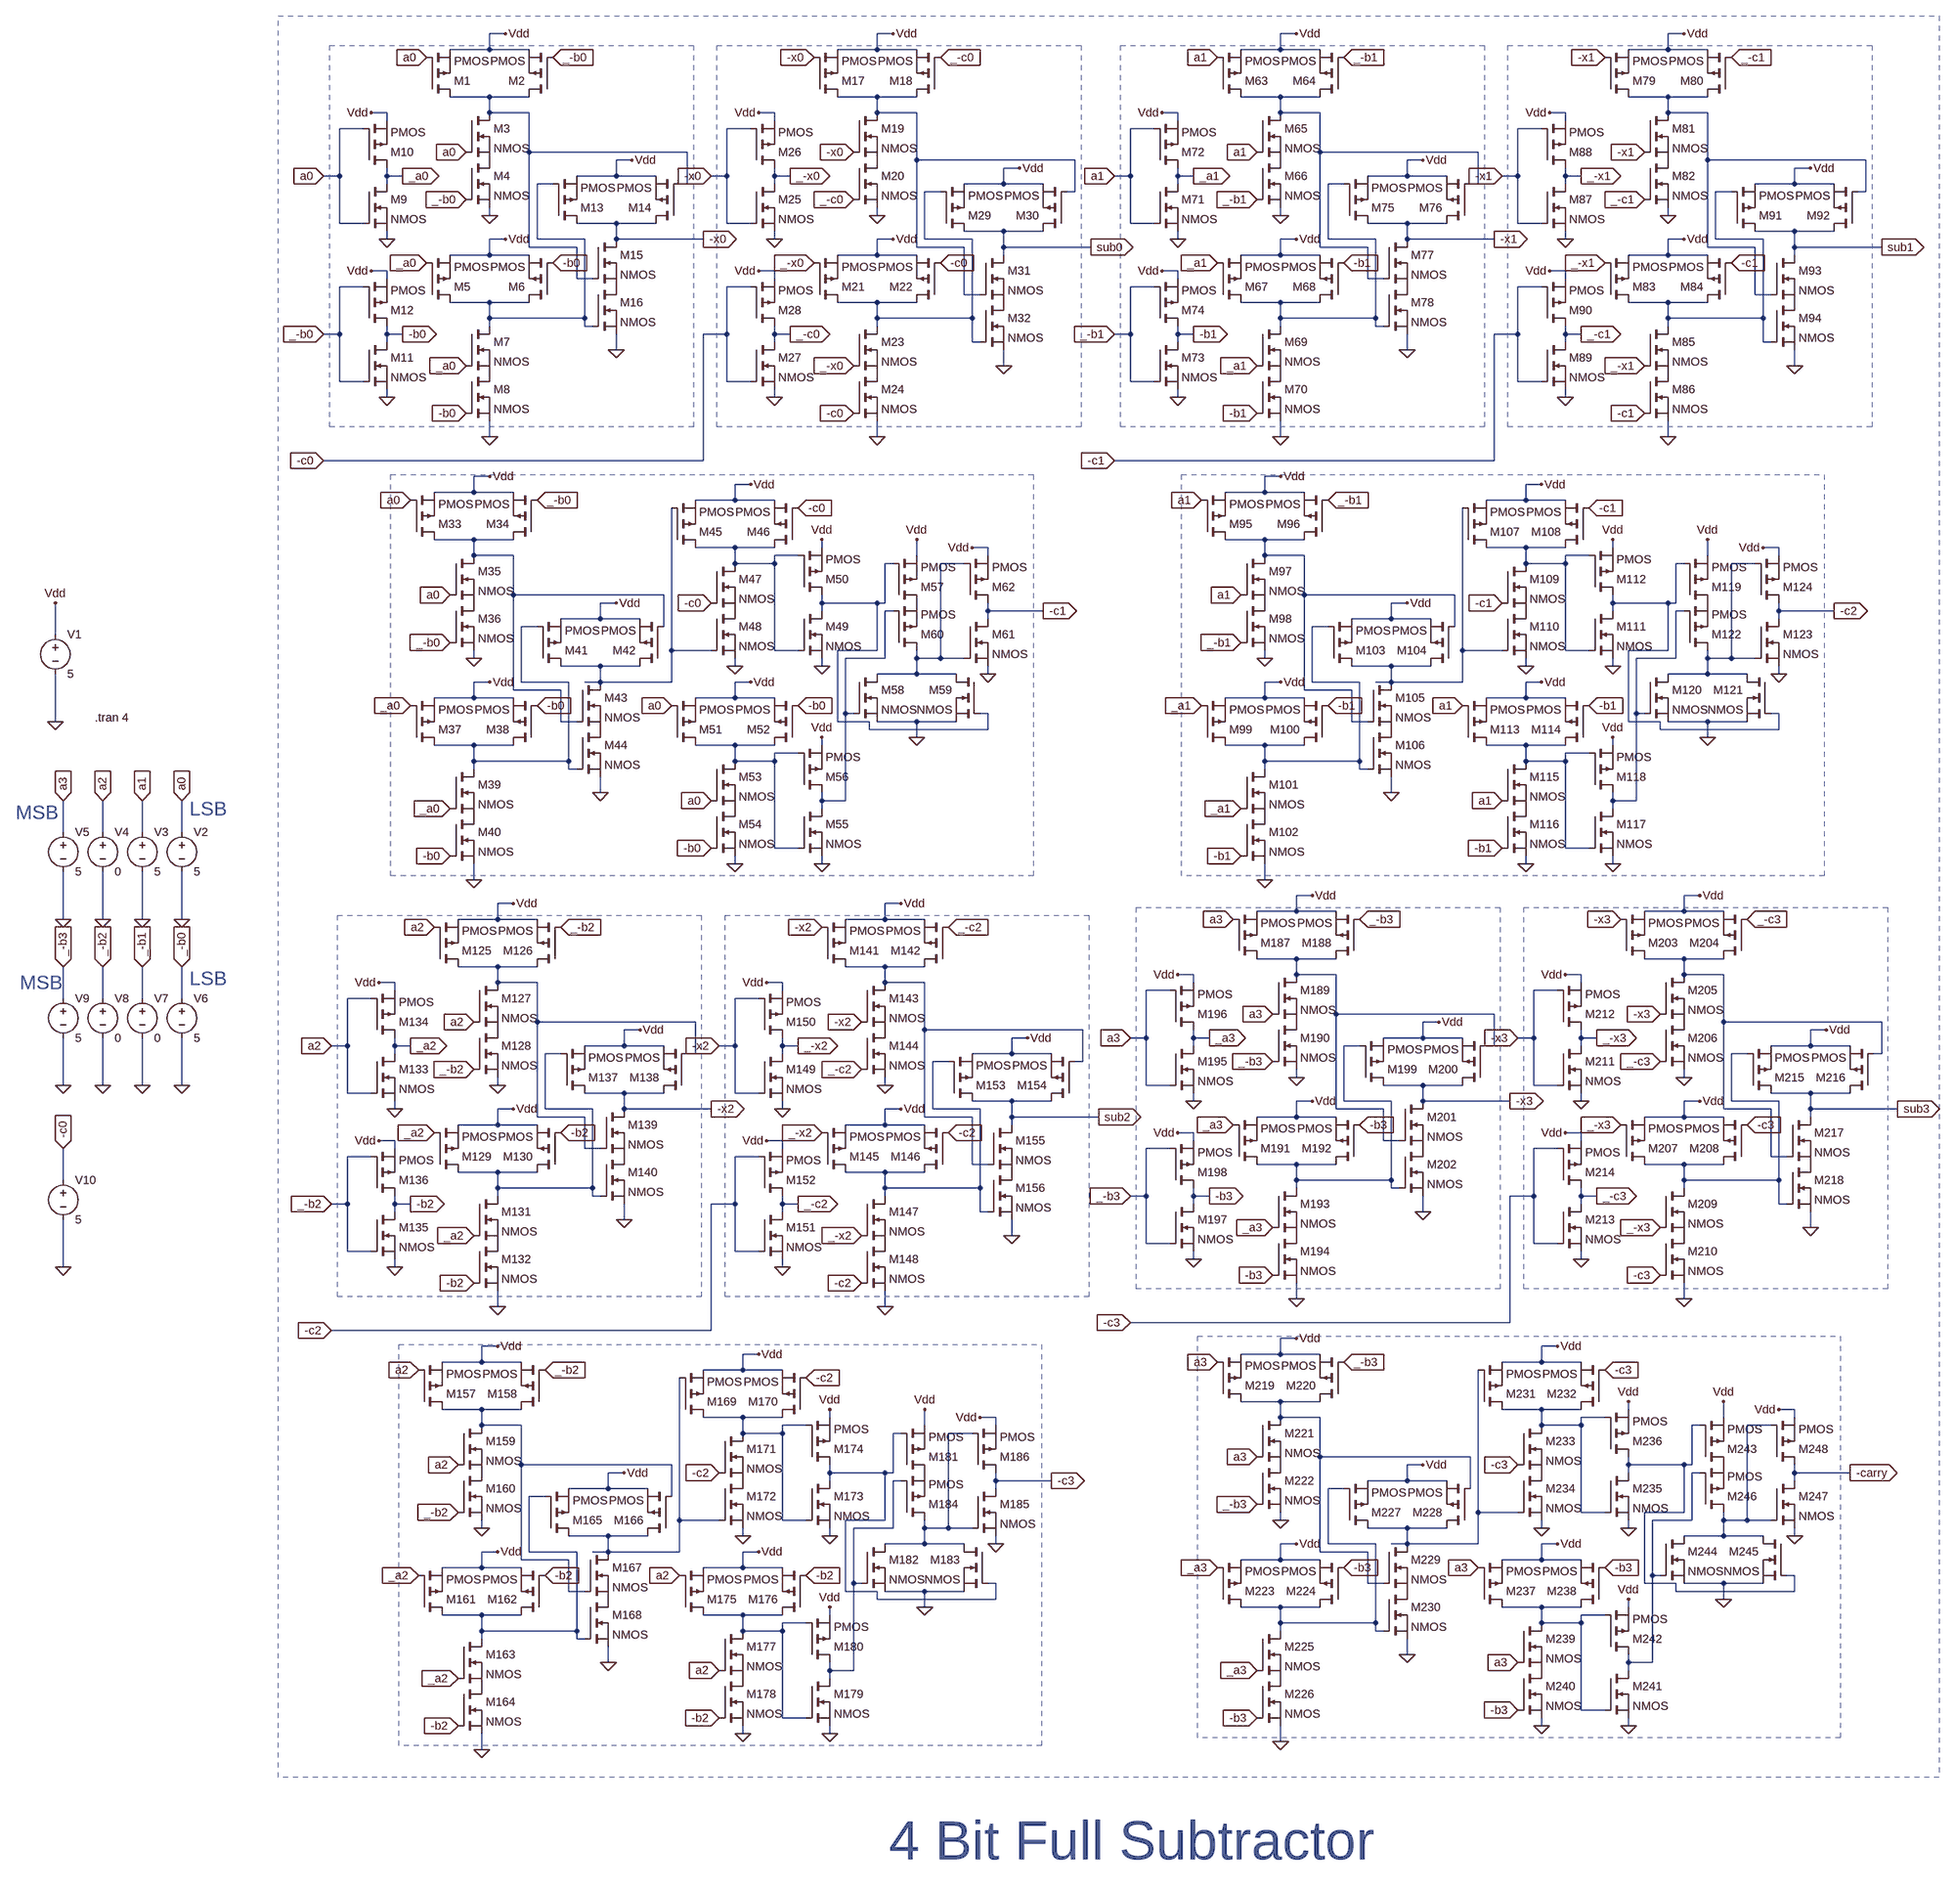
[diagram p0: schematic 4 bit full subtractor.asc]
* 4 bit full subtractor.asc
V1 Vdd 0 5
V2 a0 0 5
V3 a1 0 5
V4 a2 0 0
V5 a3 0 5
V6 _-b0 0 5
V7 _-b1 0 0
V8 _-b2 0 0
V9 _-b3 0 5
V10 -c0 0 5
M1 N001 a0 Vdd Vdd PMOS
M2 N001 _-b0 Vdd Vdd PMOS
M3 N001 a0 P001 P001 NMOS
M4 P001 _-b0 0 0 NMOS
M5 N005 _a0 Vdd Vdd PMOS
M6 N005 -b0 Vdd Vdd PMOS
M7 N005 _a0 P002 P002 NMOS
M8 P002 -b0 0 0 NMOS
M9 _a0 a0 0 0 NMOS
M10 _a0 a0 Vdd Vdd PMOS
M11 -b0 _-b0 0 0 NMOS
M12 -b0 _-b0 Vdd Vdd PMOS
M13 -x0 N005 Vdd Vdd PMOS
M14 -x0 N001 Vdd Vdd PMOS
M15 -x0 N001 P003 P003 NMOS
M16 P003 N005 0 0 NMOS
M17 N002 -x0 Vdd Vdd PMOS
M18 N002 _-c0 Vdd Vdd PMOS
M19 N002 -x0 P004 P004 NMOS
M20 P004 _-c0 0 0 NMOS
M21 N007 _-x0 Vdd Vdd PMOS
M22 N007 -c0 Vdd Vdd PMOS
M23 N007 _-x0 P005 P005 NMOS
M24 P005 -c0 0 0 NMOS
M25 _-x0 -x0 0 0 NMOS
M26 _-x0 -x0 Vdd Vdd PMOS
M27 _-c0 -c0 0 0 NMOS
M28 _-c0 -c0 Vdd Vdd PMOS
M29 sub0 N007 Vdd Vdd PMOS
M30 sub0 N002 Vdd Vdd PMOS
M31 sub0 N002 P006 P006 NMOS
M32 P006 N007 0 0 NMOS
M33 N009 a0 Vdd Vdd PMOS
M34 N009 _-b0 Vdd Vdd PMOS
M35 N009 a0 P007 P007 NMOS
M36 P007 _-b0 0 0 NMOS
M37 N019 _a0 Vdd Vdd PMOS
M38 N019 -b0 Vdd Vdd PMOS
M39 N019 _a0 P008 P008 NMOS
M40 P008 -b0 0 0 NMOS
M41 N021 N019 Vdd Vdd PMOS
M42 N021 N009 Vdd Vdd PMOS
M43 N021 N009 P009 P009 NMOS
M44 P009 N019 0 0 NMOS
M45 N011 N021 Vdd Vdd PMOS
M46 N011 -c0 Vdd Vdd PMOS
M47 N011 -c0 P010 P010 NMOS
M48 P010 N021 0 0 NMOS
M49 N013 N011 0 0 NMOS
M50 N013 N011 Vdd Vdd PMOS
M51 N023 a0 Vdd Vdd PMOS
M52 N023 -b0 Vdd Vdd PMOS
M53 N023 a0 P011 P011 NMOS
M54 P011 -b0 0 0 NMOS
M55 N017 N023 0 0 NMOS
M56 N017 N023 Vdd Vdd PMOS
M57 P012 N013 Vdd Vdd PMOS
M58 N014 N017 0 0 NMOS
M59 N014 N013 0 0 NMOS
M60 N014 N017 P012 P012 PMOS
M61 -c1 N014 0 0 NMOS
M62 -c1 N014 Vdd Vdd PMOS
M63 N003 a1 Vdd Vdd PMOS
M64 N003 _-b1 Vdd Vdd PMOS
M65 N003 a1 P013 P013 NMOS
M66 P013 _-b1 0 0 NMOS
M67 N006 _a1 Vdd Vdd PMOS
M68 N006 -b1 Vdd Vdd PMOS
M69 N006 _a1 P014 P014 NMOS
M70 P014 -b1 0 0 NMOS
M71 _a1 a1 0 0 NMOS
M72 _a1 a1 Vdd Vdd PMOS
M73 -b1 _-b1 0 0 NMOS
M74 -b1 _-b1 Vdd Vdd PMOS
M75 -x1 N006 Vdd Vdd PMOS
M76 -x1 N003 Vdd Vdd PMOS
M77 -x1 N003 P015 P015 NMOS
M78 P015 N006 0 0 NMOS
M79 N004 -x1 Vdd Vdd PMOS
M80 N004 _-c1 Vdd Vdd PMOS
M81 N004 -x1 P016 P016 NMOS
M82 P016 _-c1 0 0 NMOS
M83 N008 _-x1 Vdd Vdd PMOS
M84 N008 -c1 Vdd Vdd PMOS
M85 N008 _-x1 P017 P017 NMOS
M86 P017 -c1 0 0 NMOS
M87 _-x1 -x1 0 0 NMOS
M88 _-x1 -x1 Vdd Vdd PMOS
M89 _-c1 -c1 0 0 NMOS
M90 _-c1 -c1 Vdd Vdd PMOS
M91 sub1 N008 Vdd Vdd PMOS
M92 sub1 N004 Vdd Vdd PMOS
M93 sub1 N004 P018 P018 NMOS
M94 P018 N008 0 0 NMOS
M95 N010 a1 Vdd Vdd PMOS
M96 N010 _-b1 Vdd Vdd PMOS
M97 N010 a1 P019 P019 NMOS
M98 P019 _-b1 0 0 NMOS
M99 N020 _a1 Vdd Vdd PMOS
M100 N020 -b1 Vdd Vdd PMOS
M101 N020 _a1 P020 P020 NMOS
M102 P020 -b1 0 0 NMOS
M103 N022 N020 Vdd Vdd PMOS
M104 N022 N010 Vdd Vdd PMOS
M105 N022 N010 P021 P021 NMOS
M106 P021 N020 0 0 NMOS
M107 N012 N022 Vdd Vdd PMOS
M108 N012 -c1 Vdd Vdd PMOS
M109 N012 -c1 P022 P022 NMOS
M110 P022 N022 0 0 NMOS
M111 N015 N012 0 0 NMOS
M112 N015 N012 Vdd Vdd PMOS
M113 N024 a1 Vdd Vdd PMOS
M114 N024 -b1 Vdd Vdd PMOS
M115 N024 a1 P023 P023 NMOS
M116 P023 -b1 0 0 NMOS
M117 N018 N024 0 0 NMOS
M118 N018 N024 Vdd Vdd PMOS
M119 P024 N015 Vdd Vdd PMOS
M120 N016 N018 0 0 NMOS
M121 N016 N015 0 0 NMOS
M122 N016 N018 P024 P024 PMOS
M123 -c2 N016 0 0 NMOS
M124 -c2 N016 Vdd Vdd PMOS
M125 N027 a2 Vdd Vdd PMOS
M126 N027 _-b2 Vdd Vdd PMOS
M127 N027 a2 P025 P025 NMOS
M128 P025 _-b2 0 0 NMOS
M129 N030 _a2 Vdd Vdd PMOS
M130 N030 -b2 Vdd Vdd PMOS
M131 N030 _a2 P026 P026 NMOS
M132 P026 -b2 0 0 NMOS
M133 _a2 a2 0 0 NMOS
M134 _a2 a2 Vdd Vdd PMOS
M135 -b2 _-b2 0 0 NMOS
M136 -b2 _-b2 Vdd Vdd PMOS
M137 -x2 N030 Vdd Vdd PMOS
M138 -x2 N027 Vdd Vdd PMOS
M139 -x2 N027 P027 P027 NMOS
M140 P027 N030 0 0 NMOS
M141 N028 -x2 Vdd Vdd PMOS
M142 N028 _-c2 Vdd Vdd PMOS
M143 N028 -x2 P028 P028 NMOS
M144 P028 _-c2 0 0 NMOS
M145 N032 _-x2 Vdd Vdd PMOS
M146 N032 -c2 Vdd Vdd PMOS
M147 N032 _-x2 P029 P029 NMOS
M148 P029 -c2 0 0 NMOS
M149 _-x2 -x2 0 0 NMOS
M150 _-x2 -x2 Vdd Vdd PMOS
M151 _-c2 -c2 0 0 NMOS
M152 _-c2 -c2 Vdd Vdd PMOS
M153 sub2 N032 Vdd Vdd PMOS
M154 sub2 N028 Vdd Vdd PMOS
M155 sub2 N028 P030 P030 NMOS
M156 P030 N032 0 0 NMOS
M157 N034 a2 Vdd Vdd PMOS
M158 N034 _-b2 Vdd Vdd PMOS
M159 N034 a2 P031 P031 NMOS
M160 P031 _-b2 0 0 NMOS
M161 N044 _a2 Vdd Vdd PMOS
M162 N044 -b2 Vdd Vdd PMOS
M163 N044 _a2 P032 P032 NMOS
M164 P032 -b2 0 0 NMOS
M165 N046 N044 Vdd Vdd PMOS
M166 N046 N034 Vdd Vdd PMOS
M167 N046 N034 P033 P033 NMOS
M168 P033 N044 0 0 NMOS
M169 N036 N046 Vdd Vdd PMOS
M170 N036 -c2 Vdd Vdd PMOS
M171 N036 -c2 P034 P034 NMOS
M172 P034 N046 0 0 NMOS
M173 N039 N036 0 0 NMOS
M174 N039 N036 Vdd Vdd PMOS
M175 N048 a2 Vdd Vdd PMOS
M176 N048 -b2 Vdd Vdd PMOS
M177 N048 a2 P035 P035 NMOS
M178 P035 -b2 0 0 NMOS
M179 N042 N048 0 0 NMOS
M180 N042 N048 Vdd Vdd PMOS
M181 P036 N039 Vdd Vdd PMOS
M182 N040 N042 0 0 NMOS
M183 N040 N039 0 0 NMOS
M184 N040 N042 P036 P036 PMOS
M185 -c3 N040 0 0 NMOS
M186 -c3 N040 Vdd Vdd PMOS
M187 N025 a3 Vdd Vdd PMOS
M188 N025 _-b3 Vdd Vdd PMOS
M189 N025 a3 P037 P037 NMOS
M190 P037 _-b3 0 0 NMOS
M191 N029 _a3 Vdd Vdd PMOS
M192 N029 -b3 Vdd Vdd PMOS
M193 N029 _a3 P038 P038 NMOS
M194 P038 -b3 0 0 NMOS
M195 _a3 a3 0 0 NMOS
M196 _a3 a3 Vdd Vdd PMOS
M197 -b3 _-b3 0 0 NMOS
M198 -b3 _-b3 Vdd Vdd PMOS
M199 -x3 N029 Vdd Vdd PMOS
M200 -x3 N025 Vdd Vdd PMOS
M201 -x3 N025 P039 P039 NMOS
M202 P039 N029 0 0 NMOS
M203 N026 -x3 Vdd Vdd PMOS
M204 N026 _-c3 Vdd Vdd PMOS
M205 N026 -x3 P040 P040 NMOS
M206 P040 _-c3 0 0 NMOS
M207 N031 _-x3 Vdd Vdd PMOS
M208 N031 -c3 Vdd Vdd PMOS
M209 N031 _-x3 P041 P041 NMOS
M210 P041 -c3 0 0 NMOS
M211 _-x3 -x3 0 0 NMOS
M212 _-x3 -x3 Vdd Vdd PMOS
M213 _-c3 -c3 0 0 NMOS
M214 _-c3 -c3 Vdd Vdd PMOS
M215 sub3 N031 Vdd Vdd PMOS
M216 sub3 N026 Vdd Vdd PMOS
M217 sub3 N026 P042 P042 NMOS
M218 P042 N031 0 0 NMOS
M219 N033 a3 Vdd Vdd PMOS
M220 N033 _-b3 Vdd Vdd PMOS
M221 N033 a3 P043 P043 NMOS
M222 P043 _-b3 0 0 NMOS
M223 N043 _a3 Vdd Vdd PMOS
M224 N043 -b3 Vdd Vdd PMOS
M225 N043 _a3 P044 P044 NMOS
M226 P044 -b3 0 0 NMOS
M227 N045 N043 Vdd Vdd PMOS
M228 N045 N033 Vdd Vdd PMOS
M229 N045 N033 P045 P045 NMOS
M230 P045 N043 0 0 NMOS
M231 N035 N045 Vdd Vdd PMOS
M232 N035 -c3 Vdd Vdd PMOS
M233 N035 -c3 P046 P046 NMOS
M234 P046 N045 0 0 NMOS
M235 N037 N035 0 0 NMOS
M236 N037 N035 Vdd Vdd PMOS
M237 N047 a3 Vdd Vdd PMOS
M238 N047 -b3 Vdd Vdd PMOS
M239 N047 a3 P047 P047 NMOS
M240 P047 -b3 0 0 NMOS
M241 N041 N047 0 0 NMOS
M242 N041 N047 Vdd Vdd PMOS
M243 P048 N037 Vdd Vdd PMOS
M244 N038 N041 0 0 NMOS
M245 N038 N037 0 0 NMOS
M246 N038 N041 P048 P048 PMOS
M247 -carry N038 0 0 NMOS
M248 -carry N038 Vdd Vdd PMOS
.model NMOS NMOS
.model PMOS PMOS
.lib standard.mos
.tran 4
* LSB
* MSB
* LSB
* MSB
* 4 Bit Full Subtractor
.backanno
.end